# EAGLE design eTapper1main3 (EAGLE 8.2.2)
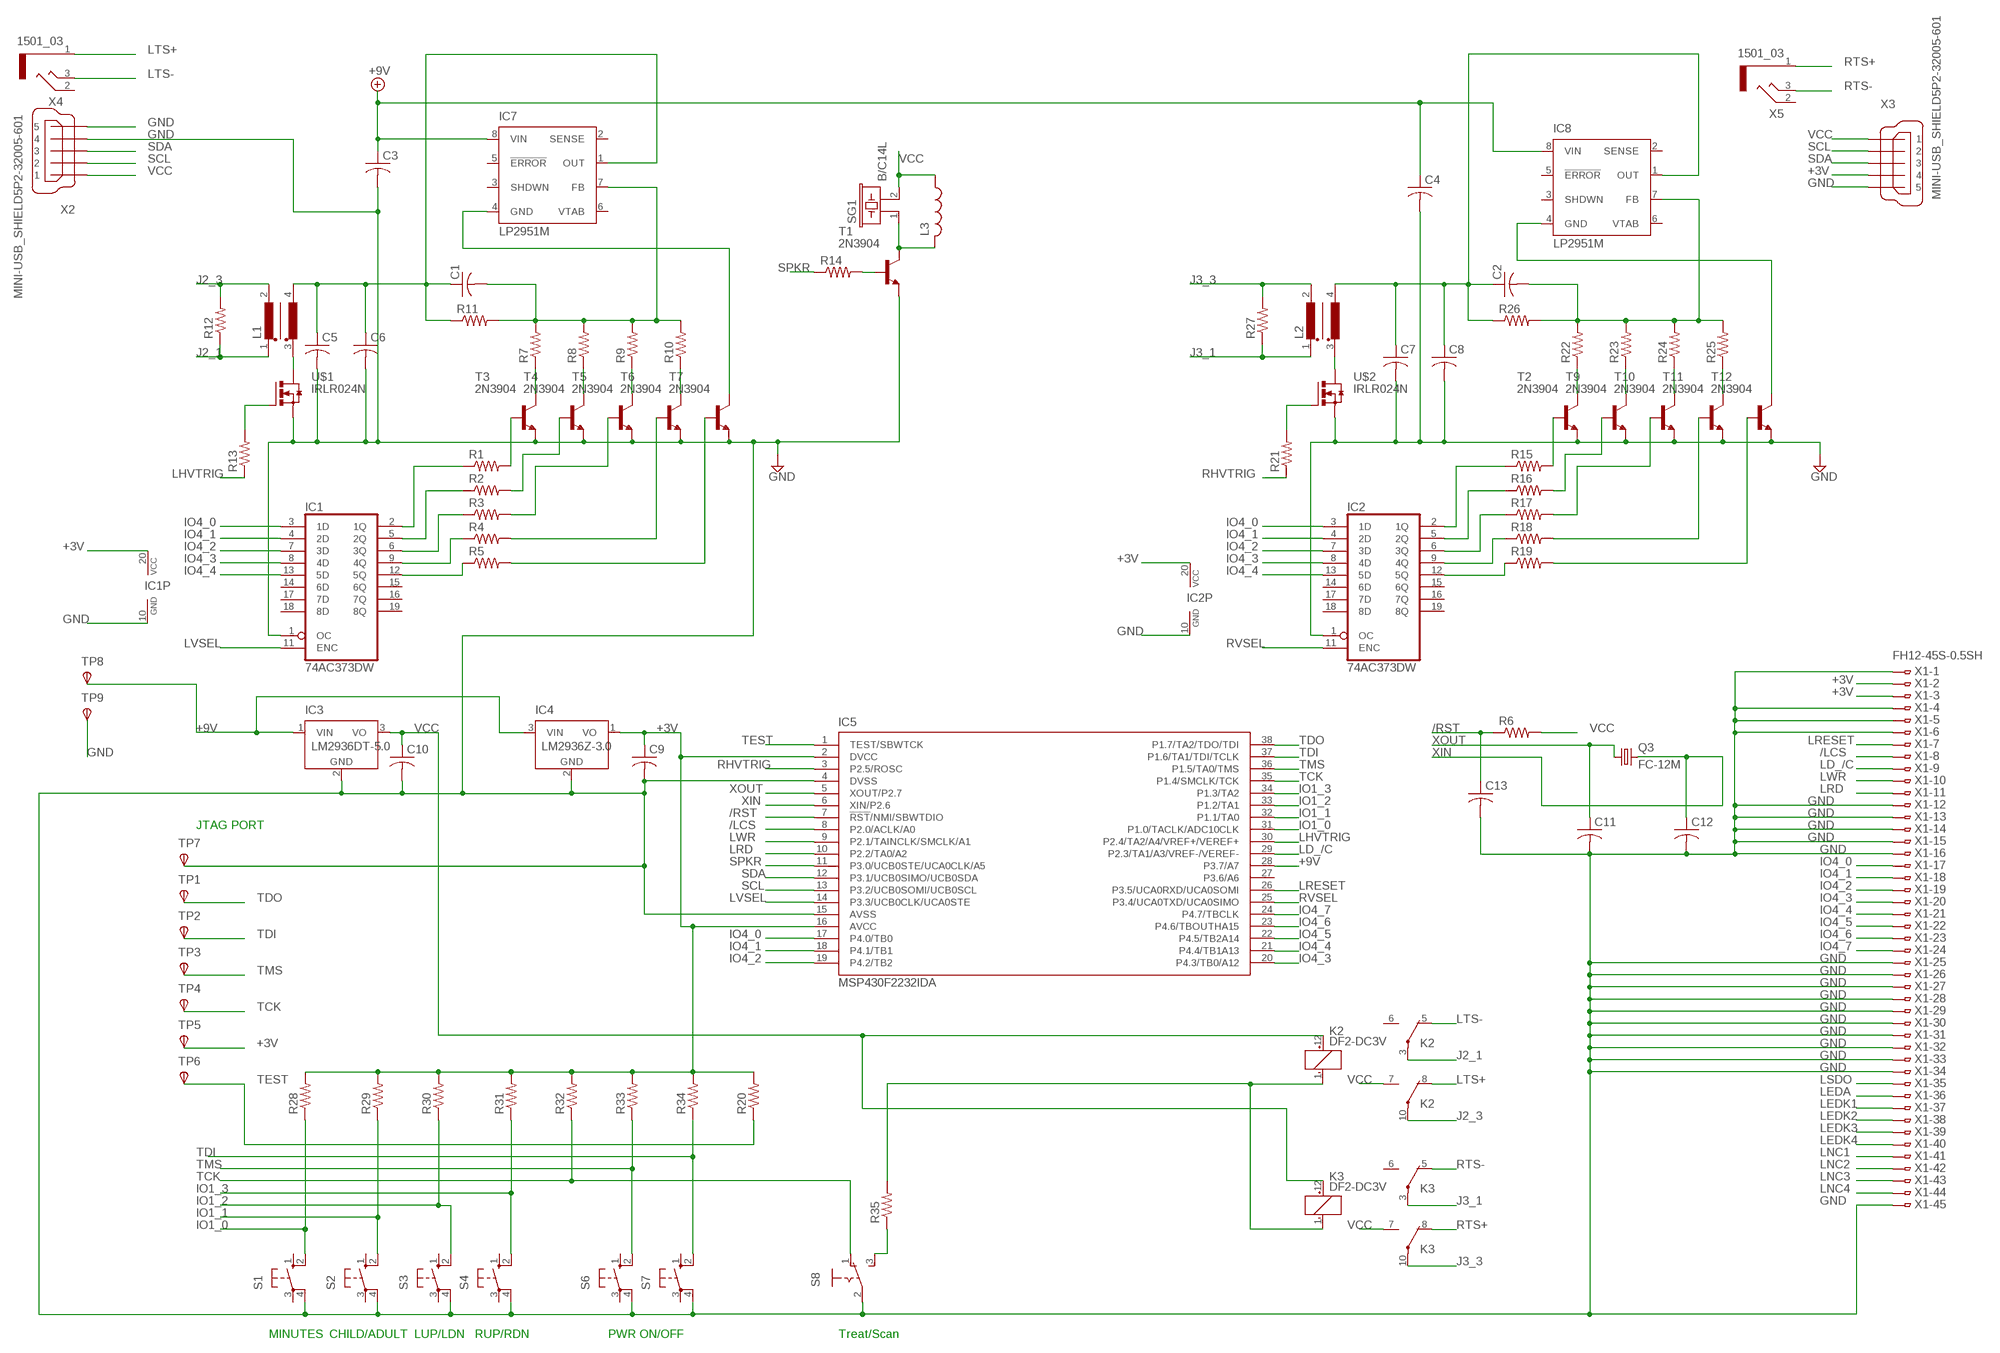
[diagram p0: schematic, sheet 1]

## Parts
C1  C-USC0805  [C0805]
C2  C-USC0805  [C0805]
C3  C-USC0805  [C0805]
C4  C-USC0805  [C0805]
C5  C-USC0805  [C0805]
C6  C-USC0805  [C0805]
C7  C-USC0805  [C0805]
C8  C-USC0805  [C0805]
C9  C-USC0805  [C0805]
C10  C-USC0805  [C0805]
C11  C-USC0805  [C0805]
C12  C-USC0805  [C0805]
C13  C-USC0805  [C0805]
IC1  74AC373DW  [SO20W]
IC2  74AC373DW  [SO20W]
IC3  LM2936DT-5.0  [TO252]
IC4  LM2936Z-3.0  [TO92]
IC5  MSP430F2232IDA  [TSSOP38_R-PDSO-G38-DA]
IC7  LP2951M  [SO08]
IC8  LP2951M  [SO08]
K2  DF2-DC3V  [DF2]
K3  DF2-DC3V  [DF2]
L1  SK9-2  [SK9]
L2  SK9-2  [SK9]
L3  L-USL2825P  [L2825P]
Q3  FC-12M  [FC-12M]
R1  R-US_R0402  [R0402]
R2  R-US_R0402  [R0402]
R3  R-US_R0402  [R0402]
R4  R-US_R0402  [R0402]
R5  R-US_R0402  [R0402]
R6  R-US_R0402  [R0402]
R7  R-US_R0402  [R0402]
R8  R-US_R0402  [R0402]
R9  R-US_R0402  [R0402]
R10  R-US_R0402  [R0402]
R11  R-US_R0402  [R0402]
R12  R-US_R0402  [R0402]
R13  R-US_R0402  [R0402]
R14  R-US_R0402  [R0402]
R15  R-US_R0402  [R0402]
R16  R-US_R0402  [R0402]
R17  R-US_R0402  [R0402]
R18  R-US_R0402  [R0402]
R19  R-US_R0402  [R0402]
R20  R-US_R0402  [R0402]
R21  R-US_R0402  [R0402]
R22  R-US_R0402  [R0402]
R23  R-US_R0402  [R0402]
R24  R-US_R0402  [R0402]
R25  R-US_R0402  [R0402]
R26  R-US_R0402  [R0402]
R27  R-US_R0402  [R0402]
R28  R-US_R0402  [R0402]
R29  R-US_R0402  [R0402]
R30  R-US_R0402  [R0402]
R31  R-US_R0402  [R0402]
R32  R-US_R0402  [R0402]
R33  R-US_R0402  [R0402]
R34  R-US_R0402  [R0402]
R35  R-US_R0402  [R0402]
S1  10-XX  [B3F-10XX]
S2  10-XX  [B3F-10XX]
S3  10-XX  [B3F-10XX]
S4  10-XX  [B3F-10XX]
S6  10-XX  [B3F-10XX]
S7  10-XX  [B3F-10XX]
S8  M251  [M251]
SG1  B/C14L  [B/C14L]
T1  2N3904  [TO92]
T2  2N3904  [TO92]
T3  2N3904  [TO92]
T4  2N3904  [TO92]
T5  2N3904  [TO92]
T6  2N3904  [TO92]
T7  2N3904  [TO92]
T9  2N3904  [TO92]
T10  2N3904  [TO92]
T11  2N3904  [TO92]
T12  2N3904  [TO92]
TP1  TPSTP06R  [TP06R]
TP2  TPSTP06R  [TP06R]
TP3  TPSTP06R  [TP06R]
TP4  TPSTP06R  [TP06R]
TP5  TPSTP06R  [TP06R]
TP6  TPSTP06R  [TP06R]
TP7  TPSTP06R  [TP06R]
TP8  TPSTP06R  [TP06R]
TP9  TPSTP06R  [TP06R]
U$1  IRLR024N  [I-PAK_TO251AA]
U$2  IRLR024N  [I-PAK_TO251AA]
X1  FH12-45S-0.5SH  [FH12-45S-0.5SH]
X2  MINI-USB_SHIELD5P2-32005-601  [32005-601]
X3  MINI-USB_SHIELD5P2-32005-601  [32005-601]
X4  1501_03  [1501_03]
X5  1501_03  [1501_03]

## Nets
+3V: C9.1 IC1.20(VCC) IC2.20(VCC) IC4.1(VO) IC5.2(DVCC) IC5.16(AVCC) R20.2 R28.2 R29.2 R30.2 R31.2 R32.2 R33.2 R34.2 TP5.TP(PP) X1.2 X1.3 X3.4
+9V: C3.1 C4.1 IC3.1(VIN) IC4.3(VIN) IC5.28(P3.7/A7) IC7.8(VIN) IC8.8(VIN) TP8.TP(PP)
/LCS: IC5.8(P2.0/ACLK/A0) X1.8
/RST: C13.1 IC5.7(!RST!/NMI/SBWTDIO) R6.1
GND: C3.2 C4.2 C5.2 C6.2 C7.2 C8.2 C9.2 C10.2 C11.2 C12.2 C13.2 IC1.1(OC) IC1.10(GND) IC2.1(OC) IC2.10(GND) IC3.2(GND) IC4.2(GND) IC5.4(DVSS) IC5.15(AVSS) S1.4(P1) S2.4(P1) S3.4(P1) S4.4(P1) S6.4(P1) S7.4(P1) S8.2(P) T1.3(E) T2.3(E) T3.3(E) T4.3(E) T5.3(E) T6.3(E) T7.3(E) T9.3(E) T10.3(E) T11.3(E) T12.3(E) TP7.TP(PP) TP9.TP(PP) U$1.3(S) U$2.3(S) X1.1 X1.4 X1.5 X1.6 X1.12 X1.13 X1.14 X1.15 X1.16 X1.25 X1.26 X1.27 X1.28 X1.29 X1.30 X1.31 X1.32 X1.33 X1.34 X1.45 X2.4 X2.5 X3.5
IO1_0: IC5.31(P1.0/TACLK/ADC10CLK) R28.1 S1.2(S1)
IO1_1: IC5.32(P1.1/TA0) R29.1 S2.2(S1)
IO1_2: IC5.33(P1.2/TA1) R30.1 S3.2(S1)
IO1_3: IC5.34(P1.3/TA2) R31.1 S4.2(S1)
IO4_0: IC1.3(1D) IC2.3(1D) IC5.17(P4.0/TB0) X1.17
IO4_1: IC1.4(2D) IC2.4(2D) IC5.18(P4.1/TB1) X1.18
IO4_2: IC1.7(3D) IC2.7(3D) IC5.19(P4.2/TB2) X1.19
IO4_3: IC1.8(4D) IC2.8(4D) IC5.20(P4.3/TB0/A12) X1.20
IO4_4: IC1.13(5D) IC2.13(5D) IC5.21(P4.4/TB1A13) X1.21
IO4_5: IC5.22(P4.5/TB2A14) X1.22
IO4_6: IC5.23(P4.6/TBOUTHA15) X1.23
IO4_7: IC5.24(P4.7/TBCLK) X1.24
J2_1: K2.3(2:P) L1.1(W1A) R12.1
J2_3: K2.10(3:P) L1.2(W1E) R12.2
J3_1: K3.3(2:P) L2.1(W1A) R27.1
J3_3: K3.10(3:P) L2.2(W1E) R27.2
LD_/C: IC5.29(P2.3/TA1/A3/VREF-/VEREF-) X1.9
LEDA: X1.36
LEDK1: X1.37
LEDK2: X1.38
LEDK3: X1.39
LEDK4: X1.40
LHVTRIG: IC5.30(P2.4/TA2/A4/VREF+/VEREF+) R13.1
LNC1: X1.41
LNC2: X1.42
LNC3: X1.43
LNC4: X1.44
LRD: IC5.10(P2.2/TA0/A2) X1.11
LRESET: IC5.26(P3.5/UCA0RXD/UCA0SOMI) X1.7
LSDO: X1.35
LTS+: K2.8(3:O) X4.1
LTS-: K2.5(2:O) X4.3
LVSEL: IC1.11(ENC) IC5.14(P3.3/UCB0CLK/UCA0STE)
LWR: IC5.9(P2.1/TAINCLK/SMCLK/A1) X1.10
N$1: IC1.2(1Q) R1.1
N$2: IC1.5(2Q) R2.1
N$3: IC1.6(3Q) R3.1
N$4: IC1.9(4Q) R4.1
N$5: IC1.12(5Q) R5.1
N$6: L3.2 SG1.1 T1.1(C)
N$7: R4.2 T6.2(B)
N$8: R5.2 T7.2(B)
N$9: L1.3(W2A) U$1.2(D) U$1.4(D)
N$10: R7.1 T3.1(C)
N$11: R8.1 T4.1(C)
N$12: R9.1 T5.1(C)
N$13: R1.2 T3.2(B)
N$14: R2.2 T4.2(B)
N$15: R3.2 T5.2(B)
N$16: R10.1 T6.1(C)
N$17: C1.2 IC7.7(FB) R7.2 R8.2 R9.2 R10.2 R11.2
N$18: C1.1 C5.1 C6.1 IC7.1(OUT) L1.4(W2E) R11.1
N$19: L2.3(W2A) U$2.2(D) U$2.4(D)
N$20: IC2.2(1Q) R15.1
N$21: R13.2 U$1.1(G)
N$22: R14.2 T1.2(B)
N$24: IC2.5(2Q) R16.1
N$25: IC2.6(3Q) R17.1
N$26: IC2.9(4Q) R18.1
N$27: IC2.12(5Q) R19.1
N$29: R15.2 T2.2(B)
N$30: R16.2 T9.2(B)
N$31: R17.2 T10.2(B)
N$32: R18.2 T11.2(B)
N$33: R19.2 T12.2(B)
N$34: K2.1(1:-) K3.1(1:-) R35.2
N$35: R22.1 T2.1(C)
N$36: R23.1 T9.1(C)
N$37: R24.1 T10.1(C)
N$38: R25.1 T11.1(C)
N$39: C2.2 IC8.7(FB) R22.2 R23.2 R24.2 R25.2 R26.2
N$40: C2.1 C7.1 C8.1 IC8.1(OUT) L2.4(W2E) R26.1
N$42: R21.2 U$2.1(G)
N$45: IC7.4(GND) T7.1(C)
N$47: IC8.4(GND) T12.1(C)
N$54: R35.1 S8.3(S)
RHVTRIG: IC5.3(P2.5/ROSC) R21.1
RTS+: K3.8(3:O) X5.1
RTS-: K3.5(2:O) X5.3
RVSEL: IC2.11(ENC) IC5.25(P3.4/UCA0TXD/UCA0SIMO)
SCL: IC5.13(P3.2/UCB0SOMI/UCB0SCL) X2.2 X3.2
SDA: IC5.12(P3.1/UCB0SIMO/UCB0SDA) X2.3 X3.3
SPKR: IC5.11(P3.0/UCB0STE/UCA0CLK/A5) R14.1
TCK: IC5.35(P1.4/SMCLK/TCK) R32.1 S8.1(O) TP4.TP(PP)
TDI: IC5.37(P1.6/TA1/TDI/TCLK) R34.1 S7.2(S1) TP2.TP(PP)
TDO: IC5.38(P1.7/TA2/TDO/TDI) TP1.TP(PP)
TEST: IC5.1(TEST/SBWTCK) R20.1 TP6.TP(PP)
TMS: IC5.36(P1.5/TA0/TMS) R33.1 S6.2(S1) TP3.TP(PP)
VCC: C10.1 IC3.3(VO) K2.7(3:S) K2.12(1:+) K3.7(3:S) K3.12(1:+) L3.1 R6.2 SG1.2 X2.1 X3.1
XIN: C12.1 IC5.6(XIN/P2.6) Q3.2
XOUT: C11.1 IC5.5(XOUT/P2.7) Q3.1
Unconnected: IC1.14(6D) IC1.15(6Q) IC1.16(7Q) IC1.17(7D) IC1.18(8D) IC1.19(8Q) IC2.14(6D) IC2.15(6Q) IC2.16(7Q) IC2.17(7D) IC2.18(8D) IC2.19(8Q) IC5.27(P3.6/A6) IC7.2(SENSE) IC7.3(SHDWN) IC7.5(!ERROR) IC7.6(VTAB) IC8.2(SENSE) IC8.3(SHDWN) IC8.5(!ERROR) IC8.6(VTAB) K2.6(2:S) K3.6(2:S) S1.1(S) S1.3(P) S2.1(S) S2.3(P) S3.1(S) S3.3(P) S4.1(S) S4.3(P) S6.1(S) S6.3(P) S7.1(S) S7.3(P) X2.M1(S1) X2.M2(S2) X3.M1(S1) X3.M2(S2) X4.2 X5.2

## Notes on the sheet
- JTAG PORT
- MINUTES | CHILD/ADULT | LUP/LDN | RUP/RDN | PWR ON/OFF | Treat/Scan

## Library data of the parts
C1-C13 = rcl:C-US: CAPACITOR, American symbol
IC1 IC2 = 74xx-eu:74*373: Octal D type transparent LATCH, edge triggered
IC3 = national-semiconductor:LM2936?*: Ultra-Low Quiescent Current LDO Voltage Regulator Source: Data sheet <http://www.national.com/ds/LM/LM2936.pdf>; MF: NATIONAL SEMICONDUCTOR; MPN: LM2936DT-5.0/NOPB; OC_FARNELL: 1286864; OC_NEWARK: 41K4501
IC4 = national-semiconductor:LM2936?*: Ultra-Low Quiescent Current LDO Voltage Regulator Source: Data sheet <http://www.national.com/ds/LM/LM2936.pdf>; MF: NATIONAL SEMICONDUCTOR; MPN: LM2936Z-3.0/NOPB; OC_FARNELL: 1312709; OC_NEWARK: 41K4531
IC5 = texas:MSP430F22*2IDA: MIXED SIGNAL MICROCONTROLLER Source: http://focus.ti.com/lit/ds/symlink/msp430f2274.pdf; MPN: MSP430F2232IDA; OC_FARNELL: 1610178; OC_NEWARK: 28M6312
IC7 IC8 = national-semiconductor:LP2951: Adjustable Micropower Voltage Regulator Source: http://www.national.com/ds/LP/LP2950.pdf; MF: FAIRCHILD SEMICONDUCTOR; MPN: LP2951CM; OC_FARNELL: 9488561; OC_NEWARK: 78K6014
K2 K3 = relay:DF2-?DC*: HIGHLY SENSITIVE DIP MINIATURE RELAY NAiS Single side stable / 1 coil latching Source: http://www.mew-europe.com/.. en_ds_61002_0000.pdf; OC_FARNELL: unknown; OC_NEWARK: unknown
L1 L2 = trafo-siemens:SK9-2: TRANSFORMER; OC_FARNELL: unknown; OC_NEWARK: unknown
L3 = rcl:L-US: INDUCTOR, American symbol
Q3 = crystal:FC-12M: kHz RANGE CRYSTAL UNIT LOW PROFILE SMD Source: Epson Toyocom FC-12M.pdf
R1-R35 = resistor:R-US_: RESISTOR, American symbol
S1-S4 S6 S7 = switch-omron:10-XX: OMRON SWITCH; MPN: B3F-1000; OC_FARNELL: 176432; OC_NEWARK: 36M3542
S8 = switch:M251: SLIDING SWITCH Mors, distributor Buerklin, 11G702
SG1 = buzzer:B/C14L: BUZZER Source: Buerklin; OC_FARNELL: unknown; OC_NEWARK: unknown
T1-T7 T9-T12 = transistor-neu-to92:2N3904: NPN TRANSISTOR
TP1-TP9 = testpad:TPS: TEST PIN
U$1 U$2 = IRLR024N:IRLR024N: IRLR024N HEXFET Power Mosfet N channel Infeneon Technology TO-251AA IPAK
X1 = con-hirose:FH12-45S-0.5S: 0.5mm Pitch Connectors For FPC/FFC Source: Data sheet <http://www.hirose.co.jp/cataloge_hp/e58605370.pdf>; OC_FARNELL: unknown; OC_NEWARK: unknown
X2 X3 = con-cypressindustries:MINI-USB_SHIELD5P2-: MINI USB-B R/A DIP 5pol. Source: www.cypressindustries.com; OC_FARNELL: unknown; OC_NEWARK: unknown
X4 X5 = con-lumberg:1501_03: Klinkensteckverbinder nach JISC 6560, 2,5 mm Jack connectors according to JISC 6560, 2.5 mm Source: http://www.lumberg.com/Produkte/PDFs/1501_03.pdf; OC_FARNELL: 1200127; OC_NEWARK: unknown

## Module LP2951
Ports: 

### Library data of the parts

## Board
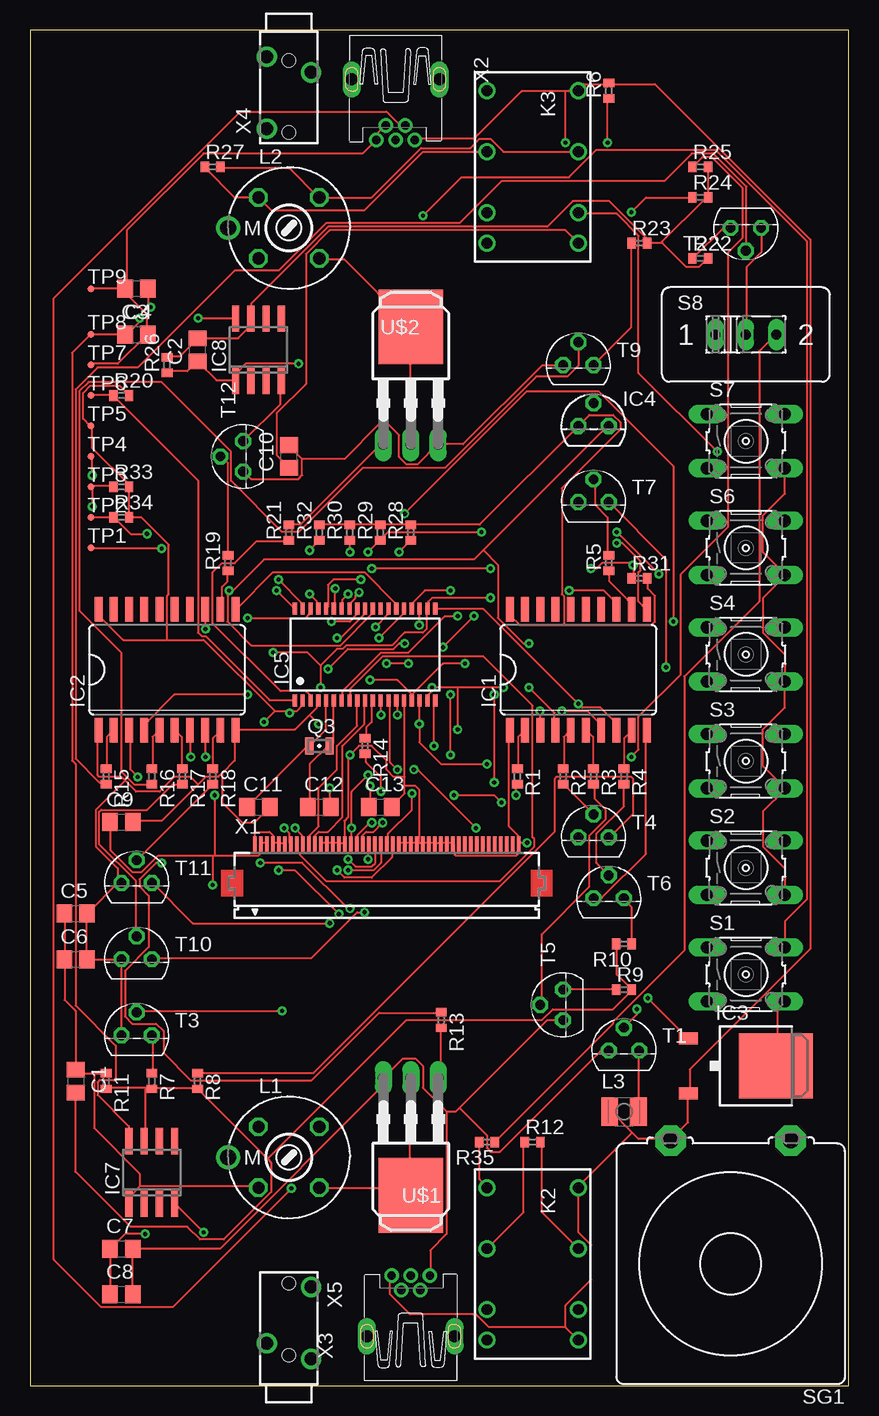
[diagram p1: board, top side]
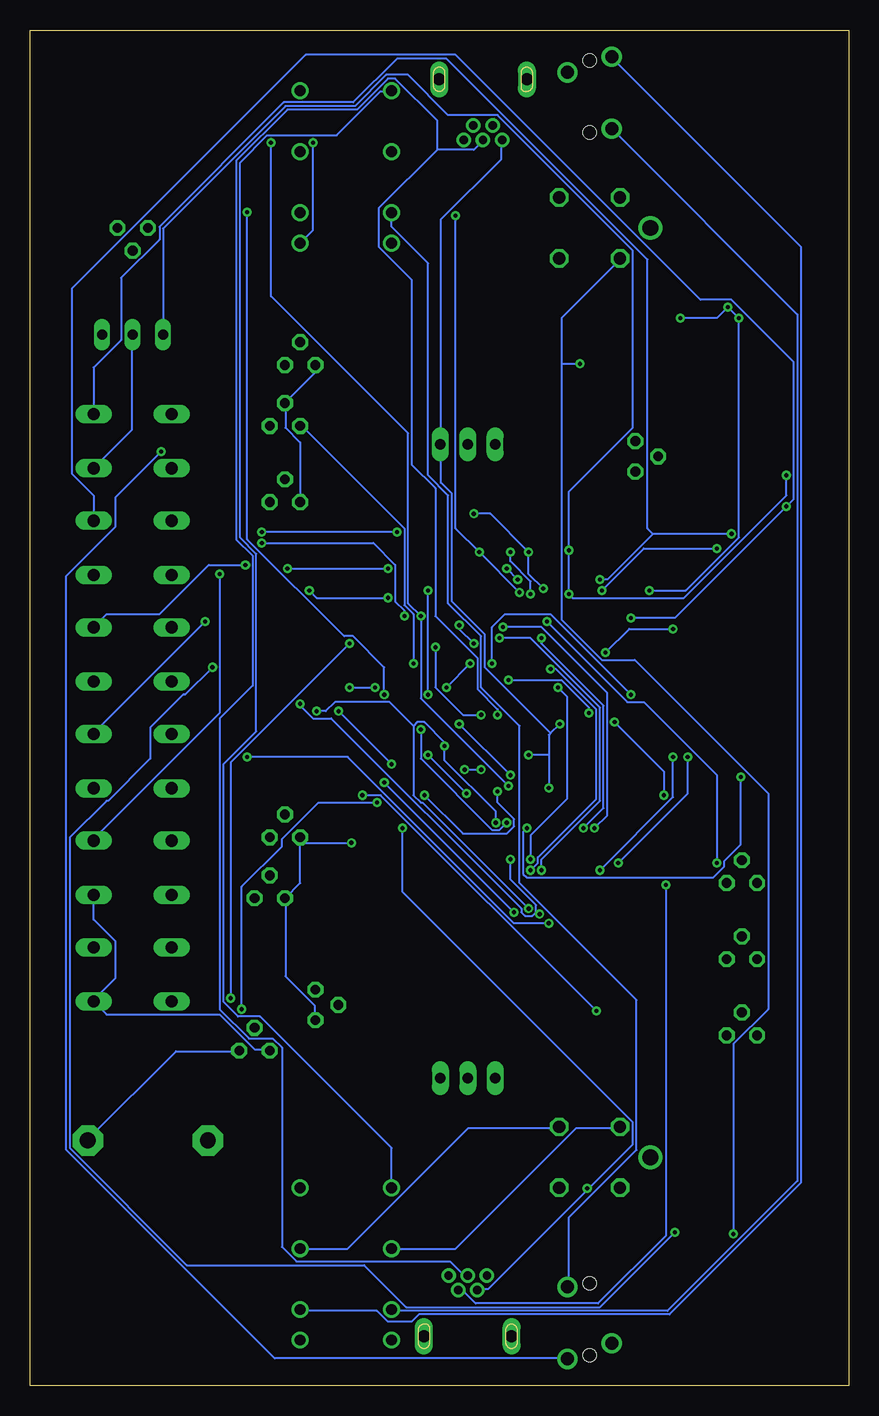
[diagram p2: board, bottom side, seen from below]

Size 68.25 x 113.02 mm. Coordinates in mm from the lower left corner, seen from the top.
Outline: 0,0 68.25,0 68.25,113.02 0,113.02 0,0
Copper layers (1*16): Top 0.035mm / dielectric 1.5mm / Bottom 0.035mm
Design rules "default": minimum track width 6mil, minimum drill 0.35mm, track to track 6mil, track to pad 6mil, pad to pad 6mil, via to via 6mil, smd to smd 6mil, copper to edge 40mil, drill to drill 6mil, minimum pad ring 10mil, minimum via ring 8mil, stop-mask expansion 4mil, vias tented up to drill 0mil, thermal gap 10mil

### Footprints (pad centres in the part's own frame; a part is rotated, then mirrored left to right if it is on the bottom)
C0805 = smd 1.3 x 1.5: 1 -0.95,0; 2 0.95,0
SO20W = smd 0.66 x 2.032: 1 -5.715,-5.029; 2 -4.445,-5.029; 3 -3.175,-5.029; 4 -1.905,-5.029; 5 -0.635,-5.029; 6 0.635,-5.029; 7 1.905,-5.029; 8 3.175,-5.029; 9 4.445,-5.029; 10 5.715,-5.029; 11 5.715,5.029; 12 4.445,5.029; 13 3.175,5.029; 14 1.905,5.029; 15 0.635,5.029; 16 -0.635,5.029; 17 -1.905,5.029; 18 -3.175,5.029; 19 -4.445,5.029; 20 -5.715,5.029
TO252 = smd 1 x 1.6: 1 -2.28,-4.8; 3 2.28,-4.8 | smd 5.4 x 6.2: 2 0,2.5
TO92 = drill 0.813 pad 1.27 octagon: 1 -1.27,0; 2 0,1.905; 3 1.27,0
TSSOP38_R-PDSO-G38-DA = smd 0.35 x 1: 1 -5.85,-3.85; 2 -5.2,-3.85; 3 -4.55,-3.85; 4 -3.9,-3.85; 5 -3.25,-3.85; 6 -2.6,-3.85; 7 -1.95,-3.85; 8 -1.3,-3.85; 9 -0.65,-3.85; 10 0,-3.85; 11 0.65,-3.85; 12 1.3,-3.85; 13 1.95,-3.85; 14 2.6,-3.85; 15 3.25,-3.85; 16 3.9,-3.85; 17 4.55,-3.85; 18 5.2,-3.85; 19 5.85,-3.85; 20 5.85,3.85; 21 5.2,3.85; 22 4.55,3.85; 23 3.9,3.85; 24 3.25,3.85; 25 2.6,3.85; 26 1.95,3.85; 27 1.3,3.85; 28 0.65,3.85; 29 0,3.85; 30 -0.65,3.85; 31 -1.3,3.85; 32 -1.95,3.85; 33 -2.6,3.85; 34 -3.25,3.85; 35 -3.9,3.85; 36 -4.55,3.85; 37 -5.2,3.85; 38 -5.85,3.85
SO08 = smd 0.6 x 2.2: 1 -1.905,-2.6; 2 -0.635,-2.6; 3 0.635,-2.6; 4 1.905,-2.6; 5 1.905,2.6; 6 0.635,2.6; 7 -0.635,2.6; 8 -1.905,2.6
DF2 = drill 0.9: 1 -6.35,-3.81; 3 -1.27,-3.81; 5 3.81,-3.81; 6 6.35,-3.81; 7 6.35,3.81; 8 3.81,3.81; 10 -1.27,3.81; 12 -6.35,3.81
SK9 = drill 1.016 octagon: 1 -2.54,2.54; 2 2.54,2.54; 3 2.54,-2.54; 4 -2.54,-2.54 | drill 1.321: M -5.08,0
L2825P = smd 1.4 x 2.4: 1 -1.2,0; 2 1.2,0
FC-12M = smd 0.7 x 1.4: 1 -0.85,0; 2 0.85,0
R0402 = smd 0.7 x 0.9: 1 -0.65,0; 2 0.65,0
B3F-10XX = drill 1.016 long: 1 -3.251,2.261; 2 3.251,2.261; 3 -3.251,-2.261; 4 3.251,-2.261
M251 = drill 0.813 long: 1 -2.54,0; 2 0,0; 3 2.54,0
B/C14L = drill 1.321 pad 2.54 octagon: 1 -5.004,-10.287; 2 5.004,-10.287
TO92' = drill 0.813 octagon: 1 1.27,0; 2 0,1.905; 3 -1.27,0
TP06R = smd 0.6 x 0.6: TP 0,0
I-PAK_TO251AA = drill 0.889 long: 1 -2.286,-5.334; 2 0,-5.334; 3 2.286,-5.334 | smd 5.334 x 6.223: 4 0,4.445
FH12-45S-0.5SH = smd 0.3 x 1.3: 1 -13,3.25; 2 -12.5,3.25; 3 -12,3.25; 4 -11.5,3.25; 5 -11,3.25; 6 -10.5,3.25; 7 -10,3.25; 8 -9.5,3.25; 9 -9,3.25; 10 -8.5,3.25; 11 -8,3.25; 12 -7.5,3.25; 13 -7,3.25; 14 -6.5,3.25; 15 -6,3.25; 16 -5.5,3.25; 17 -5,3.25; 18 -4.5,3.25; 19 -4,3.25; 20 -3.5,3.25; 21 -3,3.25; 22 -2.5,3.25; 23 -2,3.25; 24 -1.5,3.25; 25 -1,3.25; 26 -0.5,3.25; 27 0,3.25; 28 0.5,3.25; 29 1,3.25; 30 1.5,3.25; 31 2,3.25; 32 2.5,3.25; 33 3,3.25; 34 3.5,3.25; 35 4,3.25; 36 4.5,3.25; 37 5,3.25; 38 5.5,3.25; 39 6,3.25; 40 6.5,3.25; 41 7,3.25; 42 7.5,3.25; 43 8,3.25; 44 8.5,3.25; 45 9,3.25
32005-601 = drill 0.7 pad 1.016: 1 2.825,1.6; 2 1.625,0.8; 3 2.825,0; 4 1.625,-0.8; 5 2.825,-1.6 | drill 1 pad 1.422 long: M1 -2.225,3.65; M2 -2.225,-3.65
1501_03 = drill 1.1 pad 1.7: 1 -1.85,0.3; 2 1.85,-1; 3 -1.85,-5.7 | hole 1.1: 0,0; 0,-6

### Placement (x,y rotation side)
C1  3.81,25.4 270 top
C2  13.97,86.36 90 top
C3  8.89,87.63 0 top
C4  8.89,91.44 180 top
C5  3.81,39.37 0 top
C6  3.81,35.56 0 top
C7  7.62,11.43 0 top
C8  7.62,7.62 0 top
C9  7.62,46.99 0 top
C10  21.59,77.47 90 top
C11  19.05,48.26 0 top
C12  24.13,48.26 0 top
C13  29.21,48.26 0 top
IC1  45.72,59.69 0 top
IC2  11.43,59.69 0 top
IC3  59.69,26.67 270 top
IC4  46.99,80.01 0 top
IC5  27.94,60.96 0 top
IC7  10.16,17.78 0 top
IC8  19.05,86.36 0 top
K2  41.91,10.16 270 top
K3  41.91,101.6 270 top
L1  21.59,19.05 0 top
L2  21.59,96.52 0 top
L3  49.53,22.86 0 top
Q3  24.13,53.34 0 top
R1  40.64,50.8 270 top
R2  44.45,50.8 270 top
R3  46.99,50.8 270 top
R4  49.53,50.8 270 top
R5  48.26,68.58 90 top
R6  48.26,107.95 90 top
R7  10.16,25.4 270 top
R8  13.97,25.4 270 top
R9  49.53,33.02 0 top
R10  49.53,36.83 180 top
R11  6.35,25.4 270 top
R12  41.91,20.32 0 top
R13  34.29,30.48 270 top
R14  27.94,53.34 270 top
R15  6.35,50.8 270 top
R16  10.16,50.8 270 top
R17  12.7,50.8 270 top
R18  15.24,50.8 270 top
R19  16.51,68.58 90 top
R20  7.62,82.55 0 top
R21  21.59,71.12 90 top
R22  55.88,93.98 0 top
R23  50.8,95.25 0 top
R24  55.88,99.06 0 top
R25  55.88,101.6 0 top
R26  11.43,85.09 90 top
R27  15.24,101.6 0 top
R28  31.75,71.12 90 top
R29  29.21,71.12 90 top
R30  26.67,71.12 90 top
R31  50.8,67.31 0 top
R32  24.13,71.12 90 top
R33  7.62,74.93 0 top
R34  7.62,72.39 0 top
R35  38.1,20.32 180 top
S1  59.69,34.29 0 top
S2  59.69,43.18 0 top
S3  59.69,52.07 0 top
S4  59.69,60.96 0 top
S6  59.69,69.85 0 top
S7  59.69,78.74 0 top
S8  59.69,87.63 0 top
SG1  58.42,10.16 180 top
T1  2N3904  [TO92']  49.53,27.94 0 top
T2  2N3904  [TO92']  59.69,96.52 180 top
T3  2N3904  [TO92']  8.89,29.21 0 top
T4  2N3904  [TO92']  46.99,45.72 0 top
T5  2N3904  [TO92']  44.45,31.75 90 top
T6  2N3904  [TO92']  48.26,40.64 0 top
T7  2N3904  [TO92']  46.99,73.66 0 top
T9  2N3904  [TO92']  45.72,85.09 0 top
T10  2N3904  [TO92']  8.89,35.56 0 top
T11  2N3904  [TO92']  8.89,41.91 0 top
T12  2N3904  [TO92']  17.78,77.47 90 top
TP1  5.08,69.85 0 top
TP2  5.08,72.39 0 top
TP3  5.08,74.93 0 top
TP4  5.08,77.47 0 top
TP5  5.08,80.01 0 top
TP6  5.08,82.55 0 top
TP7  5.08,85.09 0 top
TP8  5.08,87.63 0 top
TP9  5.08,91.44 0 top
U$1  31.75,20.32 180 top
U$2  31.75,83.82 0 top
X1  31.75,41.91 0 top
X2  30.48,106.68 270 top
X3  31.75,6.35 90 top
X4  21.59,110.49 0 top
X5  21.59,2.54 180 top

### Tracks (layer width: path | path; a pad name or v marks a point on that pad's centre or on a via)
+3V  (via drill 0.35)
  Top 0.152: X1.3 19.66,45.26 19.36,45.26 X1.2 19.2,45.11 19.2,44.35 19.05,44.2 15.39,44.2 | 15.24,44.2 10.67,44.2 9.3,42.82 8.53,42.82 6.71,44.65 6.71,46.94 C9.1 | 15.24,44.2 15.39,44.2 | 15.24,44.2 v15.24,41.76 | R20.2 8.23,82.6 7.47,83.36 5.03,83.36 4.42,82.75 4.42,80.62 5.03,80.01 TP5.TP 5.18,80.01 5.18,78.18 8.38,74.98 R33.2 8.23,74.83 8.23,72.39 R34.2 9.3,72.39 11.58,70.1 11.58,65.99 11.43,65.84 11.43,62.18 | 20.42,56.24 21.64,56.24 | 21.64,56.24 22.25,56.24 22.71,56.69 22.71,57 IC5.2 | 20.42,56.24 14.48,62.18 11.43,62.18 | 11.43,62.18 7.77,62.18 5.79,64.16 5.79,64.62 IC2.20 | 44.5,63.4 40.84,63.4 40.08,64.16 40.08,64.62 IC1.20 | 44.5,63.4 51.82,63.4 52.12,63.7 52.12,65.84 51.51,66.45 51.51,67.21 R31.2 | R30.2 24.23,71.78 R32.2 | R30.2 29.11,71.78 R29.2 29.26,71.78 31.7,71.78 R28.2 31.85,71.78 37.49,71.78 IC4.1 46.63,80.92 48.62,80.92 49.23,80.31 49.23,79.7 44.35,74.83 44.35,65.99 44.5,65.84 44.5,63.4 | R30.2 | 31.85,57.61 31.85,57.15 IC5.16 31.85,57.61 | 31.85,57.61 34.44,60.2 v36.27,60.2 | v21.64,56.08 21.64,56.24 | v28.35,58.83 30.63,58.83 31.85,57.61 | v15.39,49.23 15.39,44.2 | 20.42,56.24 v19.51,55.32
  Bottom 0.152: v15.24,41.76 15.24,12.5 20.88,6.86 31.09,6.86 32.16,7.92 32.46,7.92 X3.4 | v36.27,60.2 36.27,64.31 37.03,65.08 37.03,71.48 45.57,80.01 IC4.1 | v21.64,56.08 21.64,56.54 23.93,58.83 v28.35,58.83 | v15.39,49.23 15.39,51.21 v19.51,55.32
+9V  (via drill 0.35)
  Top 0.152: v10.06,89.92 9.91,90.07 9.91,91.44 C4.1 | v9.14,89 9.14,88.7 8.08,87.63 C3.1 TP8.TP 5.03,87.63 3.5,86.11 3.5,52.12 3.81,51.82 3.81,31.7 7.16,28.35 7.16,25.6 7.01,25.45 5.79,25.45 5.64,25.3 5.64,24.23 8.23,21.64 8.23,20.42 IC7.8 | v14.02,89 17.07,89 IC8.8 | 16.76,66.14 19.51,68.89 37.03,68.89 37.8,69.65 | 16.76,66.14 16.46,65.84 16.46,63.7 18.44,61.72 25.91,61.72 28.5,64.31 28.5,64.77 IC5.28 | 37.8,69.65 48.16,80.01 IC4.3 | v51.51,32.31 54.86,28.96 IC3.1 | v41.6,61.87 41.15,61.87 39.01,64.01 39.01,68.43 37.8,69.65 | 16.76,66.14 v16.61,66.29
  Bottom 0.152: v14.02,89 10.97,89 v10.06,89.92 v9.14,89 9.14,70.71 13.56,66.29 v16.61,66.29 | v51.51,32.31 51.51,51.97 v41.6,61.87
/LCS
  Top 0.152: IC5.8 26.67,57.15 26.67,58.06 29.41,60.81 37.8,60.81 41.91,56.69 41.91,45.72 42.06,45.57 42.06,44.96 39.17,42.06 24.69,42.06 22.25,44.5 22.25,45.11 X1.8
/RST  (via drill 0.35)
  Top 0.152: v48.16,103.63 48.16,107.29 R6.1 | v35.66,64.16 34.59,64.16 31.55,61.11 29.26,61.11 26.06,57.91 26.06,57.15 IC5.7 | v28.35,49.99 28.35,48.31 C13.1
  Bottom 0.152: v48.16,103.63 48.16,90.83 36.73,79.4 36.73,65.23 v35.66,64.16 35.66,57.3 v28.35,49.99
GND  (via drill 0.35)
  Top 0.152: T2.3 60.96,94.49 59.74,93.27 59.74,87.63 S8.2 | S7.4 62.94,74.37 61.11,72.54 61.11,69.49 62.94,67.67 S6.4 62.94,67.51 61.11,65.68 61.11,62.79 62.94,60.96 S4.4 62.94,56.54 61.11,54.71 61.11,51.66 62.94,49.84 S3.4 62.94,49.68 61.11,47.85 61.11,44.96 62.94,43.13 S2.4 | IC3.2 62.33,26.67 62.33,31.39 62.94,32 S1.4 | TP9.TP C4.2 8.08,91.44 | 9.75,87.63 7.32,85.19 5.18,85.19 TP7.TP | 8.08,91.44 8.08,90.98 9.75,89.31 9.75,87.63 | 9.75,87.63 C3.2 | 22.71,77.27 21.64,78.33 C10.2 | 22.71,77.27 22.71,75.89 22.4,75.59 18.44,75.59 17.83,76.2 T12.3 | X2.4 29.57,105 28.96,104.39 28.96,103.94 X2.5 28.8,103.78 27.74,102.72 14.48,102.72 8.08,96.32 8.08,91.44 | T9.3 44.35,85.04 42.67,85.04 36.12,78.49 U$2.3 33.98,78.49 32.31,76.81 31.39,76.81 30.79,77.42 30.79,79.25 29.87,80.16 29.11,80.16 26.21,77.27 22.71,77.27 | X1.12 24.38,45.26 24.69,45.26 X1.13 24.84,45.26 25.15,45.26 X1.14 25.3,45.26 25.6,45.26 X1.15 25.76,45.26 26.21,45.26 | 31.24,49.99 31.24,49.38 30.18,48.31 C13.2 | 31.24,49.99 31.24,50.75 | 31.24,50.75 31.24,57 IC5.15 | 26.21,45.26 26.21,47.09 26.52,47.4 26.52,52.43 v26.67,52.58 27.43,53.34 28.5,53.34 29.72,52.12 29.72,51.36 30.33,50.75 31.24,50.75 | 26.21,45.26 X1.16 | X1.25 30.79,45.26 31.24,45.26 X1.26 31.39,45.26 31.7,45.26 X1.27 31.85,45.26 32.16,45.26 X1.28 32.31,45.26 32.46,45.26 | 32.46,45.26 32.61,45.26 X1.29 32.77,45.26 33.22,45.26 X1.30 33.38,45.26 33.68,45.26 X1.31 33.83,45.26 34.14,45.26 X1.32 34.29,45.26 34.75,45.26 X1.33 34.9,45.26 35.2,45.26 X1.34 35.36,45.11 35.36,44.35 35.51,44.2 40.54,44.2 40.69,44.35 40.69,45.11 X1.45 | IC1.1 39.93,54.56 39.93,46.63 40.69,45.87 40.69,45.26 X1.45
  Top 0.152: 31.24,49.99 32.16,49.99 32.46,49.68 32.46,45.26 | 7.62,35.51 4.88,35.51 C6.2 4.72,35.66 4.72,39.32 C5.2 4.88,39.47 7.32,41.91 | 7.62,35.51 T3.3 | 7.62,35.51 T10.3 | 20.27,45.26 20.73,45.26 X1.5 20.88,45.26 21.18,45.26 X1.6 | 18.75,46.94 18.75,46.18 | 18.75,46.18 18.75,45.26 X1.1 | 18.75,46.94 19.96,48.16 C11.2 | 20.27,45.26 20.27,45.87 19.96,46.18 18.75,46.18 | 20.27,45.26 X1.4 | 23.32,55.93 22.1,54.71 17.22,54.71 IC2.10 17.07,54.56 17.07,52.12 16,51.05 | 23.32,55.93 23.93,56.54 23.93,57 IC5.4 | 14.02,50.14 14.63,50.75 15.7,50.75 16,51.05 | 14.02,50.14 10.97,47.09 8.69,47.09 C9.2 | v24.99,49.84 24.99,48.31 C12.2 | 23.32,55.93 v24.08,55.17 | 7.92,50.44 8.84,49.53 10.82,49.53 12.04,50.75 13.41,50.75 14.02,50.14 | 7.92,50.44 7.62,50.75 5.79,50.75 5.64,50.9 5.64,54.56 IC2.1 | 18.75,46.94 17.68,46.94 16,48.62 16,51.05 | 7.32,41.91 7.32,43.13 5.49,44.96 5.49,48.01 7.92,50.44 | 7.32,41.91 T11.3 | IC1.10 51.36,54.56 51.36,44.35 47.7,40.69 47.09,40.69 T6.3 | C8.2 8.53,7.62 8.53,11.43 C7.2 15.85,11.43 29.41,24.99 29.41,25.6 U$1.3 31.09,27.28 32.16,27.28 32.77,26.67 32.77,24.84 34.75,22.86 | 34.75,22.86 34.75,12.65 33.38,11.28 33.38,9.3 X3.5 | T5.3 43.13,30.48 35.81,23.16 | 35.81,23.16 35.51,22.86 34.75,22.86 | v41.45,45.26 40.84,45.26 X1.45 | 35.81,23.16 38.1,20.88 38.1,19.81 38.41,19.51 39.17,19.51 47.55,27.89 48.16,27.89 T1.3
  Bottom 0.152: S8.2 59.74,87.63 59.74,79.7 62.94,76.5 S7.4 | T1.3 48.31,28.04 49.53,28.04 52.43,30.94 61.87,30.94 62.94,32 S1.4 62.94,32.16 61.11,33.98 61.11,37.03 62.94,38.86 S2.4 | T7.3 45.72,78.64 46.94,79.86 46.94,81.84 IC4.2 46.94,81.99 44.5,84.43 44.5,85.04 T9.3 | 33.98,78.49 33.98,97.23 28.96,102.26 28.96,103.78 X2.5 | 24.99,52.58 24.99,54.25 24.84,54.41 | 24.99,52.58 v24.99,49.84 | v24.08,55.17 24.84,54.41 | 24.99,52.58 v26.67,52.58 | T5.3 44.5,30.48 44.5,31.7 46.94,34.14 46.94,40.54 T6.3 45.72,41.91 45.72,45.26 | 45.72,45.26 v41.45,45.26 | 45.72,45.26 T4.3 | 33.98,78.49 33.98,75.29 33.07,74.37 33.07,65.38 30.33,62.64 30.33,59.89 24.84,54.41 | 33.98,78.49 U$2.3
IO1_0  (via drill 0.35)
  Top 0.152: v30.79,69.49 31.7,70.41 R28.1 | v27.43,66.14 27.13,65.84 27.13,65.68 26.67,65.23 26.67,64.92 IC5.31 | S1.2 62.94,38.71 64.77,40.54 64.77,95.4 57.15,103.02 47.24,103.02 44.96,100.74 35.97,100.74 v32.77,97.54
  Bottom 0.152: v27.43,66.14 v30.79,69.49 32.77,71.48 v32.77,97.54
IO1_1  (via drill 0.35)
  Top 0.152: v28.19,69.49 29.11,70.41 R29.1 29.26,70.56 29.87,71.17 v37.64,71.17 | v26.52,65.99 26.06,65.53 26.06,64.92 IC5.32 | v48.92,71.17 v52.43,67.67
  Bottom 0.152: v28.19,69.49 28.19,68.73 26.52,67.06 v26.52,65.99 | v52.43,67.67 52.43,56.08 62.94,45.57 S2.2 | v37.64,71.17 v48.92,71.17
IO1_2  (via drill 0.35)
  Top 0.152: v26.67,69.49 R30.1 | v25.45,66.45 25.45,64.92 IC5.33 | v53.65,63.7 53.65,76.66 47.4,82.91 41.45,82.91 v31.24,72.69
  Bottom 0.152: v25.45,66.45 26.67,67.67 v26.67,69.49 29.87,72.69 v31.24,72.69 | v53.65,63.7 62.94,54.41 S3.2
IO1_3  (via drill 0.35)
  Top 0.152: R31.1 50.29,67.36 v50.29,68.43 50.14,68.58 47.7,68.58 47.24,68.12 v46.79,68.12 | v27.58,67.21 25.3,67.21 24.84,66.75 24.84,64.92 IC5.34 | v38.41,68.12 v28.5,68.12
  Bottom 0.152: v50.29,68.43 53.34,68.43 57.45,64.31 61.87,64.31 62.94,63.25 S4.2 | v28.5,68.12 v27.58,67.21 | v46.79,68.12 v38.41,68.12
IO4_0  (via drill 0.35)
  Top 0.152: v28.19,50.9 26.82,49.53 v26.82,46.48 26.82,45.26 X1.17 | IC5.17 32.46,57 v32.46,55.17 32.46,53.65 34.29,51.82 v38.1,51.82 | v8.99,50.75 8.38,51.36 8.38,54.56 IC2.3 | v42.52,56.24 42.52,54.71 IC1.3
  Bottom 0.152: v28.19,50.9 v32.46,55.17 | v8.99,50.75 8.99,45.11 10.36,43.74 10.36,43.28 11.28,42.37 26.82,42.37 27.13,42.67 27.13,46.18 v26.82,46.48 | v38.1,51.82 v42.52,56.24
IO4_1  (via drill 0.35)
  Top 0.152: 33.68,58.06 33.83,58.22 35.66,58.22 | 33.68,58.06 33.22,57.61 33.22,57.15 IC5.18 | v39.47,58.22 35.66,58.22 | v41.6,58.22 43.74,56.08 43.74,54.71 IC1.4 | v28.5,46.94 28.35,46.94 27.28,45.87 27.28,45.26 X1.18 | 35.66,58.22 v35.66,54.71 | v18.14,57.61 12.04,57.61 9.6,55.17 9.6,54.71 IC2.4 | v31.55,60.2 v29.72,60.2 | 33.68,58.06 v33.53,58.22
  Bottom 0.152: v41.6,58.22 v39.47,58.22 | v28.5,46.94 29.11,46.33 29.72,46.33 35.66,52.27 v35.66,54.71 | v18.14,57.61 24.84,64.31 28.65,64.31 29.72,63.25 v29.72,60.2 | v33.53,58.22 v31.55,60.2
IO4_2  (via drill 0.35)
  Top 0.152: v33.68,53.34 33.68,57 IC5.19 | v29.41,46.94 28.65,46.18 28.04,46.18 27.74,45.87 27.74,45.26 X1.19 | v13.41,52.43 13.41,54.56 IC2.7 | v19.2,43.59 22.71,43.59 26.52,39.78 v26.67,39.78 | v44.35,56.24 46.48,56.24 47.55,55.17 47.55,54.71 IC1.7
  Bottom 0.152: v29.41,46.94 29.41,47.85 33.68,52.12 v33.68,53.34 33.68,53.65 35.36,55.32 35.97,55.32 36.27,55.02 | v13.41,52.43 13.41,49.38 v19.2,43.59 | v26.67,39.78 35.51,48.62 35.66,48.62 36.27,49.23 36.27,55.02 | v44.35,56.24 43.59,56.24 42.82,57 38.25,57 36.27,55.02
IO4_3  (via drill 0.35)
  Top 0.152: IC5.20 33.83,64.77 37.8,64.77 v45.72,56.84 46.02,56.54 47.55,56.54 48.77,55.32 48.77,54.71 IC1.8 | v28.19,43.89 28.19,45.11 X1.20 | v14.63,52.43 14.63,54.56 IC2.8 | v20.73,42.98 22.1,42.98 v25.76,39.32
  Bottom 0.152: v28.19,43.89 28.19,42.22 26.06,40.08 26.06,39.62 | 26.06,39.62 26.06,39.47 26.36,39.17 26.98,39.17 27.28,39.47 27.28,39.78 43.13,55.63 44.65,55.63 45.72,56.69 v45.72,56.84 | v14.63,52.43 14.63,49.07 v20.73,42.98 | 26.06,39.62 v25.76,39.32
IO4_4  (via drill 0.35)
  Top 0.152: v38.41,65.68 33.53,65.68 33.22,65.38 33.22,64.92 IC5.21 33.07,64.77 33.07,63.09 32.77,62.79 31.24,62.79 30.18,61.72 26.36,61.72 26.06,61.42 25.6,61.42 24.23,60.05 | v44.96,66.29 47.85,66.29 48.77,65.38 48.77,64.77 IC1.13 | v26.52,43.89 27.13,43.28 28.5,43.28 28.8,43.59 28.8,45.11 X1.21 | 24.23,60.05 v24.23,58.22 | v14.63,63.09 14.63,64.62 IC2.13 | v20.27,61.11 23.16,61.11 24.23,60.05
  Bottom 0.152: v38.41,65.68 44.35,65.68 v44.96,66.29 | v26.52,43.89 26.52,45.87 23.47,48.92 23.47,57.45 v24.23,58.22 | v14.63,63.09 18.29,63.09 v20.27,61.11
IO4_5  (via drill 0.35)
  Top 0.152: v32.46,63.4 32.46,64.77 IC5.22 | v31.24,61.87 30.79,61.87 30.33,61.42 26.52,61.42 v24.84,59.74 | v26.52,42.98 28.65,42.98 29.26,43.59 29.26,45.11 X1.22
  Bottom 0.152: v32.46,63.4 32.46,63.09 v31.24,61.87 | v24.84,59.74 24.38,59.74 21.03,56.39 21.03,48.92 25.91,44.04 25.91,43.59 v26.52,42.98
IO4_6  (via drill 0.35)
  Top 0.152: v35.05,66.29 32.92,66.29 31.85,65.23 31.85,64.92 IC5.23 | v35.05,52.58 v35.05,57.61 | v31.85,49.38 31.85,48.01 29.87,46.02 29.87,45.26 X1.23
  Bottom 0.152: v35.05,57.61 v35.05,66.29 | v31.85,49.38 v35.05,52.58
IO4_7  (via drill 0.35)
  Top 0.152: v29.11,62.33 31.09,64.31 31.09,64.77 IC5.24 | v25.6,42.98 26.21,42.37 28.5,42.37 30.18,44.04 30.18,45.11 X1.24
  Bottom 0.152: v29.11,62.33 26.52,62.33 20.73,56.54 20.73,48.77 25.6,43.89 v25.6,42.98
J2_1
  Top 0.152: K2.3 41.15,14.48 41.15,20.27 R12.1
  Bottom 0.152: K2.3 32.77,11.43 22.71,21.49 19.05,21.49 L1.1
J2_3
  Top 0.152: K2.10 42.67,14.48 42.67,20.27 R12.2
  Bottom 0.152: K2.10 41.76,11.43 31.7,21.49 24.23,21.49 L1.2
J3_1
  Top 0.152: R27.1 14.63,101.5 17.07,99.06 L2.1 20.12,97.99 27.89,97.99 32.77,102.87 K3.3
J3_3
  Top 0.152: R27.2 16,101.5 21.64,101.5 24.08,99.06 L2.2 28.5,99.06 32.61,103.17 36.73,103.17 37.49,103.94 38.41,103.94 39.47,102.87 K3.10
LD_/C  (via drill 0.35)
  Top 0.152: v25.6,62.33 25.91,62.33 27.89,64.31 27.89,64.77 IC5.29 | v22.1,46.48 22.71,45.87 22.71,45.26 X1.9
  Bottom 0.152: v25.6,62.33 25.6,61.87 20.42,56.69 20.42,48.16 v22.1,46.48
LHVTRIG  (via drill 0.35)
  Top 0.152: v10.97,43.59 10.52,43.59 9.14,42.22 9.14,41.6 9.91,40.84 9.91,36.58 7.92,34.59 7.92,30.79 8.53,30.18 10.52,30.18 11.12,29.57 11.12,27.74 13.41,25.45 23.47,25.45 29.11,31.09 34.29,31.09 R13.1 | v25.15,63.7 26.67,63.7 27.28,64.31 27.28,64.77 IC5.30
  Bottom 0.152: v10.97,43.59 10.97,50.9 17.07,57 18.44,57 v25.15,63.7
LRD
  Top 0.152: IC5.10 27.89,57 27.89,55.17 26.06,53.34 26.06,47.4 24.84,46.18 24.08,46.18 23.77,45.87 23.77,45.26 X1.11
LRESET  (via drill 0.35)
  Top 0.152: v28.8,63.25 29.87,64.31 29.87,64.77 IC5.26 | v21.18,46.48 21.64,46.02 21.64,45.26 X1.7
  Bottom 0.152: v28.8,63.25 25.6,63.25 20.12,57.76 20.12,47.55 v21.18,46.48
LTS+
  Bottom 0.152: K2.8 45.72,6.25 39.32,6.25 38.41,5.33 36.42,5.33 35.81,5.94 14.94,5.94 3.96,16.92 3.96,94.94 19.66,110.64 X4.1
LTS-
  Bottom 0.152: K2.5 38.1,6.25 15.09,6.25 4.27,17.07 4.27,89.31 19.66,104.7 X4.3
LVSEL  (via drill 0.35)
  Top 0.152: v30.63,55.93 30.63,57 IC5.14 | v37.03,64.16 v34.44,61.57 | v48.92,70.26 49.38,70.26 50.9,68.73 50.9,67.97 50.75,67.82 50.75,65.38 51.36,64.77 IC1.11
  Bottom 0.152: v30.63,55.93 32.16,55.93 34.44,58.22 v34.44,61.57 | v37.03,64.16 37.03,64.62 37.8,65.38 37.8,68.43 39.62,70.26 v48.92,70.26
LWR
  Top 0.152: IC5.9 27.28,57 27.28,55.02 25.6,53.34 25.6,51.36 24.08,49.84 24.08,46.63 23.32,45.87 23.32,45.26 X1.10
N$1
  Top 0.152: R1.1 40.69,51.51 40.69,54.1 41.15,54.56 IC1.2
N$2
  Top 0.152: R2.1 44.5,51.51 44.5,54.1 44.96,54.56 IC1.5
N$3
  Top 0.152: R3.1 46.94,51.51 46.94,54.1 46.48,54.56 IC1.6
N$4
  Top 0.152: R4.1 49.53,53.95 50.14,54.56 IC1.9
N$5
  Top 0.152: R5.1 48.31,67.82 48.31,67.06 50.14,65.23 50.14,64.77 IC1.12
N$6
  Top 0.152: L3.2 50.75,22.86 50.75,27.89 T1.1
  Bottom 0.152: T1.1 50.9,27.89 56.08,27.89 63.4,20.57 SG1.1
N$7
  Top 0.152: R4.2 49.53,48.31 47.24,46.02 47.24,43.59 48.16,42.67 T6.2
N$8
  Top 0.152: R5.2 48.16,69.34 48.16,72.39 47.09,73.46 47.09,75.44 T7.2
N$9
  Top 0.152: 31.7,16.46 31.7,16 U$1.4 31.7,16.46 | 31.7,16.46 31.7,25.6 U$1.2 | 31.7,16.46 24.23,16.46 L1.3
N$10
  Top 0.152: R7.1 10.21,26.06 10.21,29.11 T3.1
N$11
  Top 0.152: R8.1 14.02,26.06 23.62,26.06 43.74,46.18 43.74,50.6 43.89,50.75 50.14,50.75 50.29,50.6 50.29,47.7 48.31,45.72 T4.1
N$12
  Top 0.152: R9.1 48.77,33.07 44.5,33.07 T5.1
N$13  (via drill 0.35)
  Top 0.152: v40.54,49.23 40.54,50.14 R1.2 | v21.03,31.24 8.99,31.24 T3.2
  Bottom 0.152: v40.54,49.23 39.01,49.23 v21.03,31.24
N$14
  Top 0.152: R2.2 44.5,50.14 46.94,47.7 T4.2
N$15
  Top 0.152: R3.2 47.09,50.14 47.09,48.92 48.01,48.01 48.01,47.24 46.63,45.87 46.63,41.6 42.67,37.64 42.67,31.85 T5.2
N$16
  Top 0.152: R10.1 50.14,36.88 50.14,39.93 49.53,40.54 T6.1
N$17
  Top 0.152: R10.2 48.92,36.73 48.92,34.29 50.14,33.07 R9.2 50.14,32.92 48.62,31.39 43.59,31.39 42.67,30.48 31.39,30.48 19.81,18.9 | 9.6,24.84 10.06,24.84 R7.2 10.21,24.84 13.87,24.84 R8.2 14.02,24.69 19.81,18.9 | 9.6,24.84 6.4,24.84 R11.2 | C1.2 3.81,17.83 8.38,13.26 13.11,13.26 14.17,12.19 16.15,12.19 20.12,16.15 20.12,18.59 19.81,18.9 | 9.6,24.84 9.6,20.42 IC7.7
N$18
  Top 0.152: 9.14,16.61 8.38,15.85 8.38,15.24 IC7.1 | 9.14,16.61 19.05,16.61 L1.4 | 5.33,26.06 3.96,26.06 3.81,26.21 C1.1 3.81,31.24 2.9,32.16 2.9,35.51 C6.1 2.9,35.66 2.9,39.32 C5.1 | 5.33,26.06 6.25,26.06 R11.1 | 9.14,16.61 9.14,17.68 5.33,21.49 5.33,26.06
N$19
  Top 0.152: U$2.2 31.7,78.49 31.7,88.24 U$2.4 31.7,88.39 26.21,93.88 24.23,93.88 L2.3
N$20
  Top 0.152: R15.1 6.4,51.51 6.4,54.1 6.86,54.56 IC2.2
N$21
  Top 0.152: R13.2 34.29,25.91 U$1.1
N$22  (via drill 0.35)
  Top 0.152: v29.26,49.53 29.26,50.75 28.04,51.97 28.04,52.58 R14.2 | v35.36,49.23 38.71,49.23 v39.32,48.62 | v50.6,31.39 50.6,30.94 49.53,29.87 T1.2
  Bottom 0.152: v29.26,49.53 29.26,48.62 27.89,47.24 27.89,46.63 28.5,46.02 32.16,46.02 v35.36,49.23 | v39.32,48.62 44.2,48.62 47.24,45.57 47.24,44.96 50.6,41.6 v50.6,31.39
N$24
  Top 0.152: R16.1 10.21,51.51 10.21,54.1 10.67,54.56 IC2.5
N$25
  Top 0.152: R17.1 12.65,51.51 12.65,54.1 12.19,54.56 IC2.6
N$26
  Top 0.152: R18.1 15.24,53.95 15.85,54.56 IC2.9
N$27
  Top 0.152: R19.1 16.46,67.82 16.46,67.06 16,66.6 16,64.77 IC2.12
N$29
  Top 0.152: R15.2 6.25,50.29 5.79,50.29 3.81,52.27 3.81,83.06 5.64,84.89 8.99,84.89 17.07,92.96 20.73,92.96 24.69,96.93 35.81,96.93 39.32,100.43 52.88,100.43 55.17,102.72 57,102.72 59.74,99.97 59.74,94.64 T2.2
N$30
  Top 0.152: T9.2 45.72,85.04 44.81,84.12 42.22,84.12 34.59,76.5 27.74,76.5 22.4,71.17 21.03,71.17 16.76,75.44 16.76,77.88 10.97,83.67 4.88,83.67 4.12,82.91 4.12,64.62 7.62,61.11 7.62,51.21 8.69,50.14 10.06,50.14 R16.2
N$31
  Top 0.152: R17.2 12.65,50.14 11.89,50.14 9.75,48.01 5.94,48.01 5.79,47.85 5.79,45.11 8.84,42.06 8.84,37.49 T10.2
N$32
  Top 0.152: R18.2 8.99,43.89 T11.2
N$33
  Top 0.152: R19.2 16.46,69.34 16.46,76.96 16,77.42 T12.2
N$34
  Top 0.152: R35.2 37.49,20.27 37.49,17.22 38.1,16.61 K2.1
  Bottom 0.152: K2.1 38.1,19.81 49.07,30.79 50.9,30.79 52.12,32 52.12,51.82 49.38,54.56 49.38,69.34 50.75,70.71 50.75,101.96 48.46,104.24 42.67,104.24 39.01,107.9 38.1,107.9 K3.1
N$35
  Top 0.152: R22.1 55.32,94.03 57.76,96.47 58.37,96.47 T2.1
N$36
  Top 0.152: T9.1 50.14,88.24 R23.1
N$37  (via drill 0.35)
  Top 0.152: R24.1 51.36,99.06 v50.14,97.84 | v38.71,50.29 v38.71,57.61 | v27.89,39.47 27.28,39.47 23.47,35.66 10.21,35.66 T10.1
  Bottom 0.152: v50.14,97.84 50.14,70.56 42.06,62.48 41.3,62.48 38.71,59.89 v38.71,57.61 | v27.89,39.47 v38.71,50.29
N$38  (via drill 0.35)
  Top 0.152: v50.14,52.43 50.75,53.03 50.75,55.78 54.25,59.28 54.25,67.67 58.22,71.63 58.22,94.49 59.44,95.71 59.44,99.82 56.84,102.41 56.08,102.41 55.32,101.65 R25.1 | v24.99,38.56 13.56,38.56 10.21,41.91 T11.1
  Bottom 0.152: v50.14,52.43 41.76,52.43 27.89,38.56 v24.99,38.56
N$39
  Top 0.152: R26.2 11.43,85.8 12.5,85.8 13.87,87.17 C2.2 14.02,87.33 17.37,87.33 18.29,88.24 18.29,88.85 IC8.7 18.44,89 18.44,90.22 24.84,96.62 43.13,96.62 45.26,98.75 48.31,98.75 51.36,95.71 51.36,95.25 R23.2 52.58,95.25 | R25.2 56.54,101.5 R24.2 56.39,99.06 52.58,95.25 | 52.58,95.25 52.73,95.25 54.71,93.27 55.78,93.27 56.39,93.88 R22.2
N$40  (via drill 0.35)
  Top 0.152: R26.1 11.43,84.58 13.11,84.58 13.87,85.34 C2.1 14.02,85.34 15.54,83.82 17.07,83.82 IC8.1 17.22,83.82 17.22,84.43 17.98,85.19 v22.4,85.19 | 6.71,11.43 6.71,7.62 C8.1 | 6.71,11.43 7.92,12.65 v9.6,12.65 | 6.71,11.43 C7.1
  Bottom 0.152: v9.6,12.65 9.6,28.5 6.71,31.39 6.71,49.38 17.83,60.5 20.57,60.5 23.93,63.86 23.93,85.19 | 23.93,85.19 23.93,89 19.05,93.88 L2.4 | 23.93,85.19 v22.4,85.19
N$42
  Top 0.152: U$2.1 29.26,78.49 22.55,71.78 21.64,71.78 R21.2
N$45  (via drill 0.35)
  Top 0.152: v14.48,12.8 12.19,15.09 IC7.4 | v53.03,59.89 53.03,68.89 T7.1
  Bottom 0.152: v14.48,12.8 20.73,6.55 36.88,6.55 40.39,10.06 55.17,10.06 64.92,19.81 64.92,45.72 61.87,48.77 61.72,48.77 58.22,52.27 58.22,54.86 55.47,57.61 55.32,57.61 v53.03,59.89
N$47
  Top 0.152: T12.1 20.88,81.84 20.88,83.67 IC8.4
N$54
  Top 0.152: R35.1 38.86,20.42 48.62,30.18 48.62,30.33 54.56,36.27 54.56,59.13 60.81,65.38 60.81,86.26 62.18,87.63 S8.3
RHVTRIG
  Top 0.152: R21.1 21.49,70.41 18.9,70.41 17.07,68.58 16,68.58 15.24,67.82 15.24,63.55 20.88,57.91 23.01,57.91 23.32,57.61 23.32,57.15 IC5.3
RTS+  (via drill 0.35)
  Top 0.152: v57.3,77.88 50.75,84.43 50.75,95.86 48.92,97.69 45.72,97.69 K3.8
  Bottom 0.152: v57.3,77.88 61.11,74.07 61.11,71.63 65.23,67.51 65.23,19.66 47.85,2.29 23.47,2.29 X5.1
RTS-
  Bottom 0.152: K3.5 38.1,96.62 35.05,93.57 35.05,75.89 33.38,74.22 33.38,65.23 30.63,62.48 30.63,58.22 27.43,55.02 27.43,41.91 17.68,32.16 17.68,19.66 23.32,14.02 23.32,8.38 X5.3
RVSEL
  Top 0.152: IC5.25 30.48,64.92 30.48,65.23 27.89,67.82 20.27,67.82 17.22,64.77 IC2.11
SCL  (via drill 0.35)
  Top 0.152: v30.63,51.36 30.02,51.97 30.02,57 IC5.13 | v32,51.36 32.31,51.36 v37.19,46.48 | v21.79,16.46 11.89,6.55 5.94,6.55 1.98,10.52 1.98,90.68 17.53,106.22 29.72,106.22 30.79,105.16 31.24,105.16 X2.2
  Bottom 0.152: v32,51.36 v30.63,51.36 | v37.19,46.48 37.19,41.15 17.98,21.95 17.98,20.12 21.64,16.46 | 21.64,16.46 30.02,8.08 30.94,8.08 X3.2 | 21.64,16.46 v21.79,16.46
SDA  (via drill 0.35)
  Top 0.152: v29.26,55.93 29.26,57 IC5.12
  Bottom 0.152: v29.26,55.93 29.26,56.39 30.94,58.06 30.94,60.66 34.44,64.16 34.44,74.83 36.42,76.81 36.42,92.2 39.17,94.94 39.17,98.15 34.29,103.02 | 34.29,103.02 31.24,103.02 30.48,103.78 X2.3 | 34.29,103.02 34.29,105.46 37.8,108.97 38.41,108.97 41,106.38 46.79,106.38 51.05,102.11 51.05,70.56 49.68,69.19 49.68,58.37 52.43,55.63 52.43,31.39 49.99,28.96 48.01,28.96 47.24,28.19 47.24,11.58 46.02,10.36 33.22,10.36 32.16,9.3 31.85,9.3 X3.3
SPKR
  Top 0.152: R14.1 28.04,54.1 28.04,54.86 28.5,55.32 28.5,57 IC5.11
TCK  (via drill 0.35)
  Top 0.152: v5.18,75.89 5.18,77.42 TP4.TP | v23.32,65.99 23.93,65.38 23.93,64.92 IC5.35 | v23.32,69.65 24.08,70.41 R32.1
  Bottom 0.152: v5.18,75.89 5.18,74.22 13.72,65.68 23.01,65.68 v23.32,65.99 v23.32,69.65 23.32,74.52 17.98,79.86 17.98,94.64 29.26,105.92 33.38,105.92 36.73,109.27 38.56,109.27 41.15,106.68 46.94,106.68 57.15,96.47 S8.1
TDI  (via drill 0.35)
  Top 0.152: TP2.TP R34.1 7.01,72.39 8.38,71.02 v9.75,71.02 | v20.73,67.21 22.71,65.23 22.71,64.92 IC5.37
  Bottom 0.152: v20.73,67.21 20.12,67.21 16.31,71.02 | v9.75,71.02 16.31,71.02 | S7.2 62.94,84.89 60.66,87.17 60.66,92.35 57.45,95.56 57.45,96.62 47.09,106.98 41.3,106.98 37.64,110.64 33.53,110.64 16.76,93.88 16.76,71.48 16.31,71.02
TDO  (via drill 0.35)
  Top 0.152: v10.97,69.8 5.18,69.8 TP1.TP | v20.57,66.29 21.95,64.92 IC5.38
  Bottom 0.152: v10.97,69.8 17.07,69.8 v20.57,66.29
TEST
  Top 0.152: TP6.TP 5.18,82.6 6.86,82.6 R20.1 7.01,82.45 14.02,75.44 14.02,62.79 14.33,62.48 14.63,62.48 19.96,57.15 21.95,57.15 IC5.1
TMS  (via drill 0.35)
  Top 0.152: R33.1 6.86,74.98 5.18,74.98 TP3.TP 5.18,74.83 v5.18,73.3 | v18.14,64.01 23.01,64.01 23.32,64.31 23.32,64.77 IC5.36
  Bottom 0.152: v18.14,64.01 14.48,64.01 v5.18,73.3 4.57,73.91 4.57,85.34 9.75,90.53 12.34,90.53 32.77,110.95 45.26,110.95 64.77,91.44 64.77,76.05 62.94,74.22 S6.2
VCC  (via drill 0.35)
  Top 0.152: 50.14,21.18 50.75,20.57 53.34,20.57 SG1.2 53.49,20.57 54.86,21.95 54.86,24.38 IC3.3 55.02,24.54 55.02,26.36 65.08,36.42 65.08,95.56 52.12,108.51 48.31,108.51 R6.2 48.16,108.51 46.18,108.51 45.72,108.05 K3.12 45.72,107.9 44.65,107.9 | 50.14,21.18 48.46,22.86 L3.1 | 50.14,21.18 50.14,21.03 45.72,16.61 K2.12 45.72,12.8 46.79,11.73 46.79,8.84 44.65,6.71 44.65,4.88 | 44.65,4.88 38.25,4.88 37.19,5.94 31.7,5.94 30.02,7.62 30.02,9.14 X3.1 | K2.7 44.65,4.88 | 44.65,107.9 41,107.9 37.03,103.94 32.16,103.94 X2.1 | K3.7 44.65,96.32 24.99,96.32 23.01,94.34 23.01,83.52 20.57,81.08 20.57,77.57 21.49,76.66 C10.1 | v44.65,103.63 44.65,107.9
  Bottom 0.152: v44.65,103.63 44.65,96.32 K3.7
XIN
  Top 0.152: IC5.6 25.3,57 25.3,53.65 24.99,53.34 Q3.2 24.84,53.34 23.32,51.82 23.32,48.31 C12.1
XOUT
  Top 0.152: IC5.5 24.69,57 24.69,54.71 23.32,53.34 Q3.1 23.16,53.34 18.14,48.31 C11.1